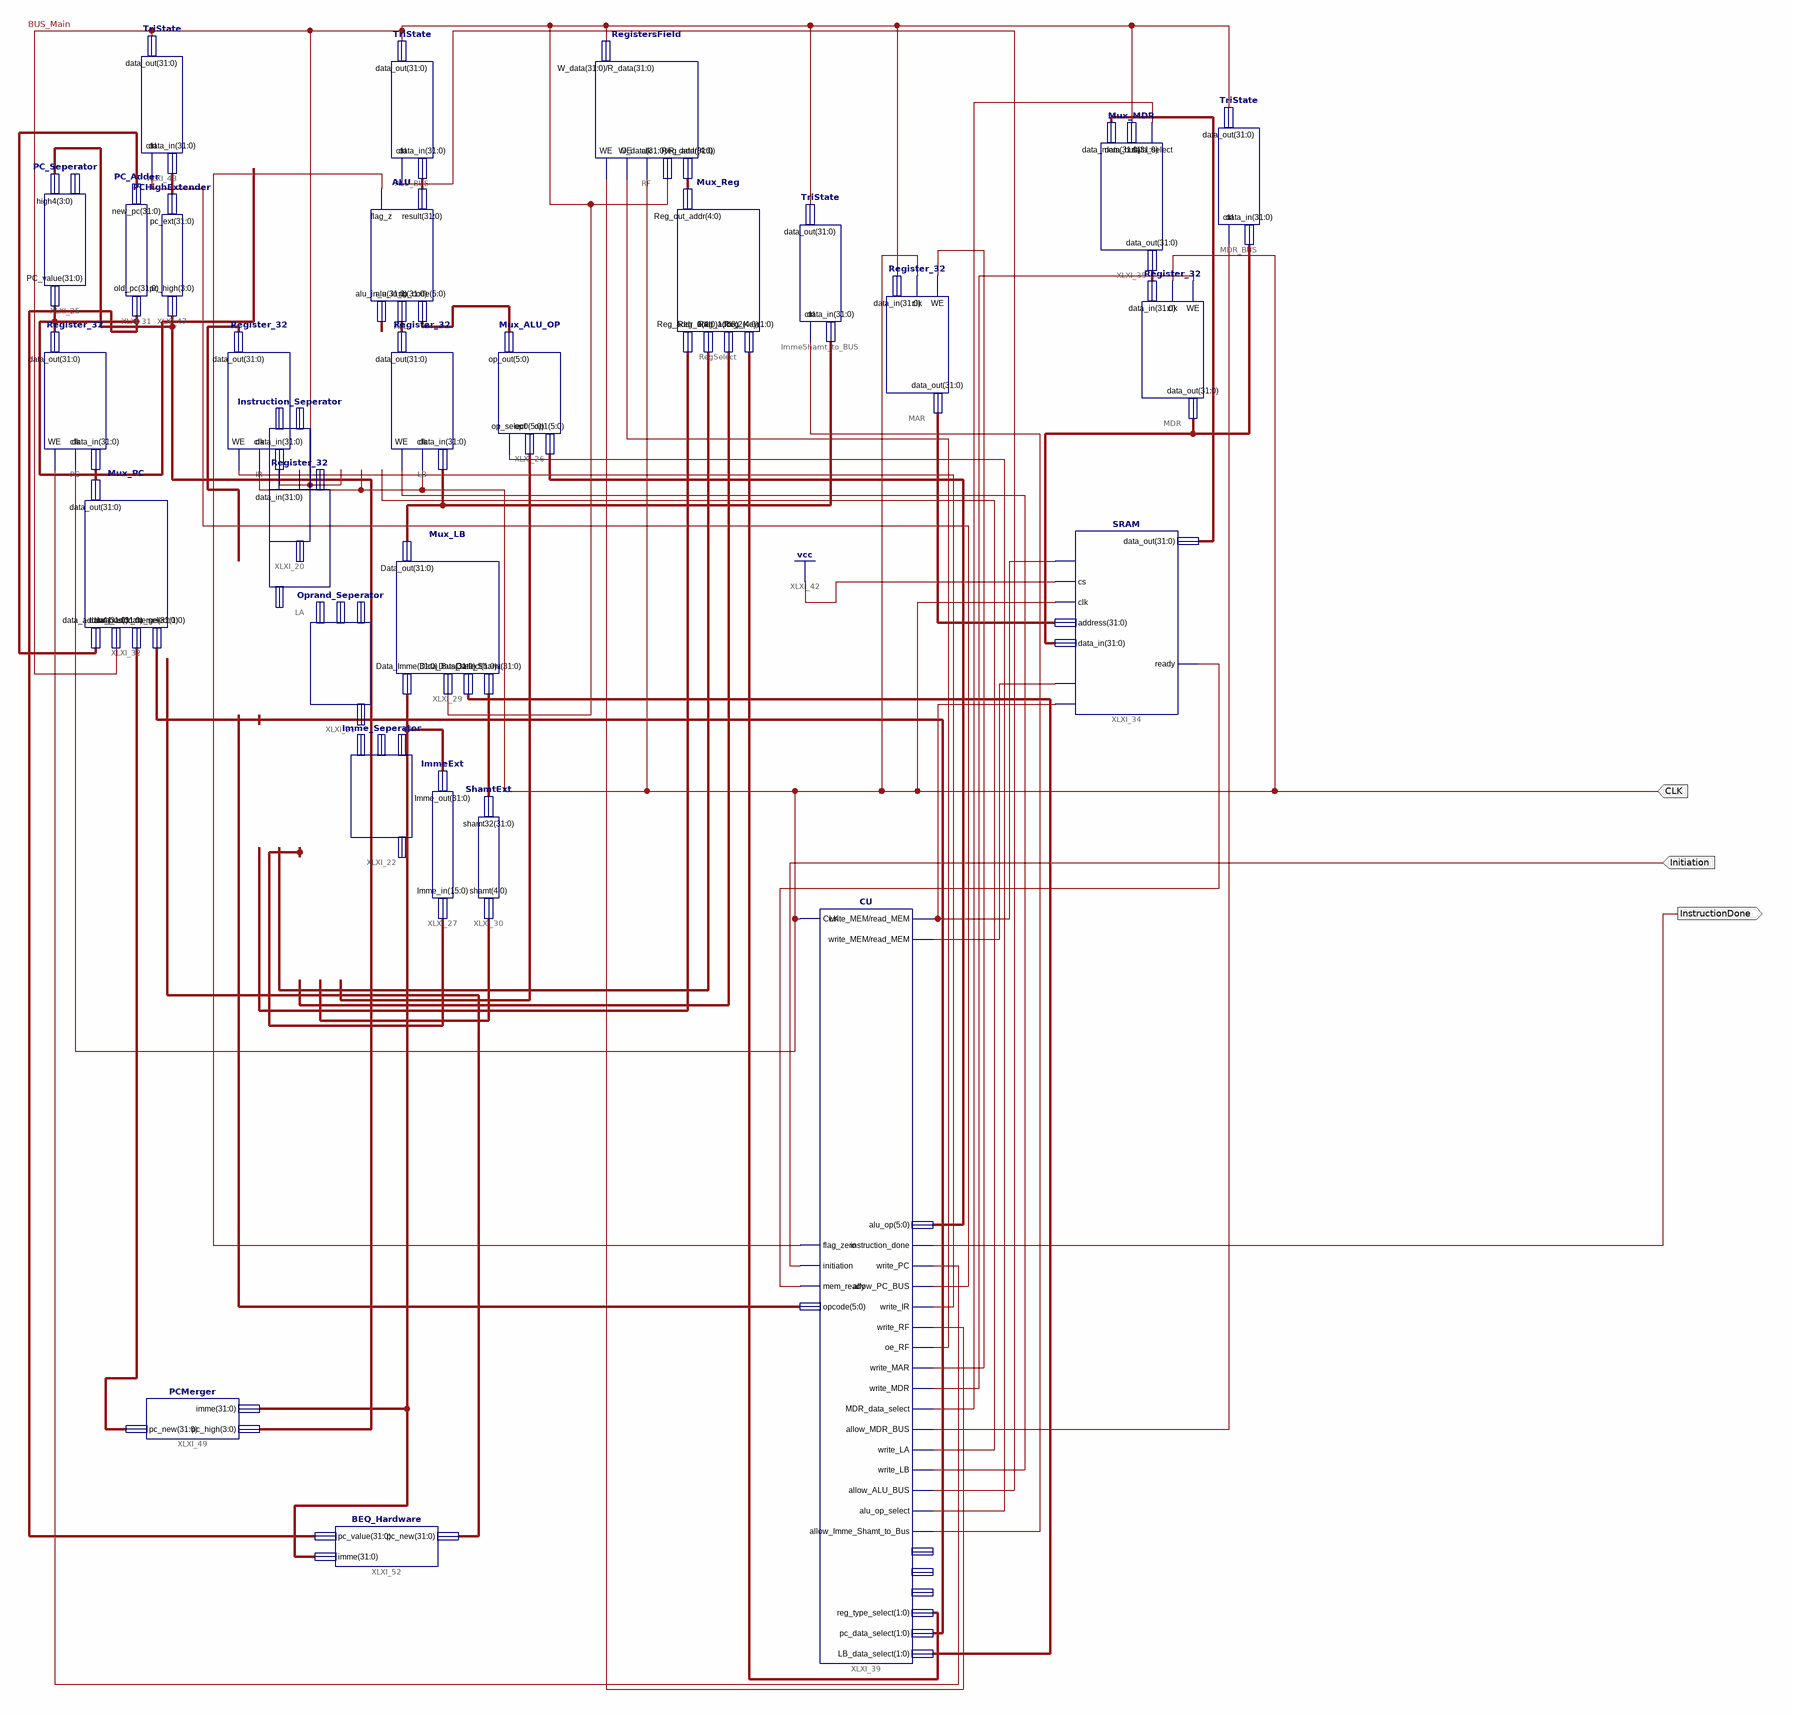
[diagram p0: schematic sheet 1]
// Xilinx ISE schematic MyCPU1_a.sch (xc9500) as structural Verilog: 29 symbols, 3 ports
module MyCPU1_a (
  input  CLK,
  input  Initiation,
  output InstructionDone
);

  wire BUS_Main, XLXN_65, XLXN_67, XLXN_68, XLXN_69, XLXN_70, XLXN_71, XLXN_72, XLXN_73, XLXN_74, XLXN_75,
       XLXN_77, XLXN_78, XLXN_90, XLXN_92, XLXN_93, XLXN_102, XLXN_120;
  wire [1:0] XLXN_79, XLXN_80, XLXN_100;
  wire [3:0] XLXN_104;
  wire [4:0] XLXN_11, XLXN_29, XLXN_30, XLXN_31, XLXN_43;
  wire [5:0] XLXN_35, XLXN_36, XLXN_63, XLXN_66;
  wire [15:0] XLXN_38;
  wire [25:0] XLXN_25;
  wire [31:0] XLXN_6, XLXN_14, XLXN_16, XLXN_20, XLXN_21, XLXN_44, XLXN_47, XLXN_48, XLXN_50, XLXN_53,
       XLXN_55, XLXN_101, XLXN_103, XLXN_105, XLXN_121, XLXN_122, XLXN_123;

  ALU ALU (.alu_in_a(XLXN_16), .alu_in_b(XLXN_14), .op_code(XLXN_36), .flag_z(XLXN_65), .result(XLXN_6));
  TriState ALU_BUS (.ctrl(XLXN_77), .data_in(XLXN_6), .data_out({32{BUS_Main}}));
  Register_32 LA (.WE(XLXN_75), .clk(CLK), .data_in({32{BUS_Main}}), .data_out(XLXN_16));
  Register_32 LB (.WE(XLXN_90), .clk(CLK), .data_in(XLXN_101), .data_out(XLXN_14));
  Register_32 IR (.WE(XLXN_68), .clk(CLK), .data_in({32{BUS_Main}}), .data_out(XLXN_21));
  Register_32 PC (.WE(XLXN_67), .clk(CLK), .data_in(XLXN_47), .data_out(XLXN_103));
  Register_32 MAR (.WE(XLXN_71), .clk(CLK), .data_in({32{BUS_Main}}), .data_out(XLXN_55));
  Instruction_Seperator XLXI_20 (.instruction_in(XLXN_21), .OPcode(XLXN_63), .OPrand(XLXN_25));
  Oprand_Seperator XLXI_21 (.oprand(XLXN_25), .Rs(XLXN_29), .Rt(XLXN_30), .Imme(XLXN_38));
  Imme_Seperator XLXI_22 (.Imme(XLXN_38), .Rd(XLXN_31), .shamt(XLXN_43), .alu_func(XLXN_35));
  PC_Seperator XLXI_25 (.PC_value(XLXN_103), .high4(XLXN_104));  // open: low4
  ImmeExt XLXI_27 (.Imme_in(XLXN_38), .Imme_out(XLXN_122));
  Mux_LB XLXI_29 (
    .Data_Imme(XLXN_122), .Data_Bus({32{BUS_Main}}), .Data_select(XLXN_100), .Data_out(XLXN_101),
    .Data_Shamt(XLXN_44));
  ShamtExt XLXI_30 (.shamt(XLXN_43), .shamt32(XLXN_44));
  PC_Adder XLXI_31 (.old_pc(XLXN_103), .new_pc(XLXN_48));
  Mux_PC XLXI_32 (
    .data_adder4(XLXN_48), .data_bus({32{BUS_Main}}), .data_addr_merge(XLXN_121), .data_select(XLXN_80),
    .data_out(XLXN_47));
  SRAM XLXI_34 (
    .oe(XLXN_93), .cs(1'b1), .clk(CLK), .address(XLXN_55), .data_in(XLXN_20), .ready(XLXN_92),
    .data_out(XLXN_53), .write1(XLXN_93), .read1(XLXN_93));
  TriState MDR_BUS (.ctrl(XLXN_74), .data_in(XLXN_20), .data_out({32{BUS_Main}}));
  Register_32 MDR (.WE(XLXN_72), .clk(CLK), .data_in(XLXN_50), .data_out(XLXN_20));
  Mux_MDR XLXI_35 (.data_select(XLXN_73), .data_bus({32{BUS_Main}}), .data_mem(XLXN_53), .data_out(XLXN_50));
  CU XLXI_39 (
    .CLK(CLK), .write_MEM(XLXN_93), .read_MEM(XLXN_93), .alu_op(XLXN_66), .flag_zero(XLXN_65),
    .initiation(Initiation), .mem_ready(XLXN_92), .opcode(XLXN_63), .instruction_done(InstructionDone),
    .write_PC(XLXN_67), .allow_PC_BUS(XLXN_120), .write_IR(XLXN_68), .write_RF(XLXN_69), .oe_RF(XLXN_70),
    .write_MAR(XLXN_71), .write_MDR(XLXN_72), .MDR_data_select(XLXN_73), .allow_MDR_BUS(XLXN_74),
    .write_LA(XLXN_75), .write_LB(XLXN_90), .allow_ALU_BUS(XLXN_77), .alu_op_select(XLXN_78),
    .allow_Imme_Shamt_to_Bus(XLXN_102), .reg_type_select(XLXN_79), .pc_data_select(XLXN_80),
    .LB_data_select(XLXN_100));  // open: test_MCounter, test_opcode, test_Miinstruct
  TriState ImmeShamt_to_BUS (.ctrl(XLXN_102), .data_in(XLXN_101), .data_out({32{BUS_Main}}));
  Mux_ALU_OP XLXI_26 (.op_select(XLXN_78), .op0(XLXN_35), .op1(XLXN_66), .op_out(XLXN_36));
  RegistersField RF (
    .WE(XLXN_69), .OE(XLXN_70), .clk(CLK), .W_data({32{BUS_Main}}), .Reg_addr(XLXN_11),
    .R_data({32{BUS_Main}}));
  Mux_Reg RegSelect (
    .Reg_addr_0(XLXN_29), .Reg_addr_1(XLXN_30), .Reg_addr_2(XLXN_31), .Reg_Key(XLXN_79),
    .Reg_out_addr(XLXN_11));
  PCHighExtender XLXI_47 (.pc_high(XLXN_104), .pc_ext(XLXN_105));
  TriState XLXI_48 (.ctrl(XLXN_120), .data_in(XLXN_105), .data_out({32{BUS_Main}}));
  PCMerger XLXI_49 (.pc_high(XLXN_104), .imme(XLXN_122), .pc_new(XLXN_121));
  BEQ_Hardware XLXI_52 (.pc_value(XLXN_103), .imme(XLXN_122), .pc_new(XLXN_123));
endmodule
